# Altium schematic sheet esp32.SchDoc
size A
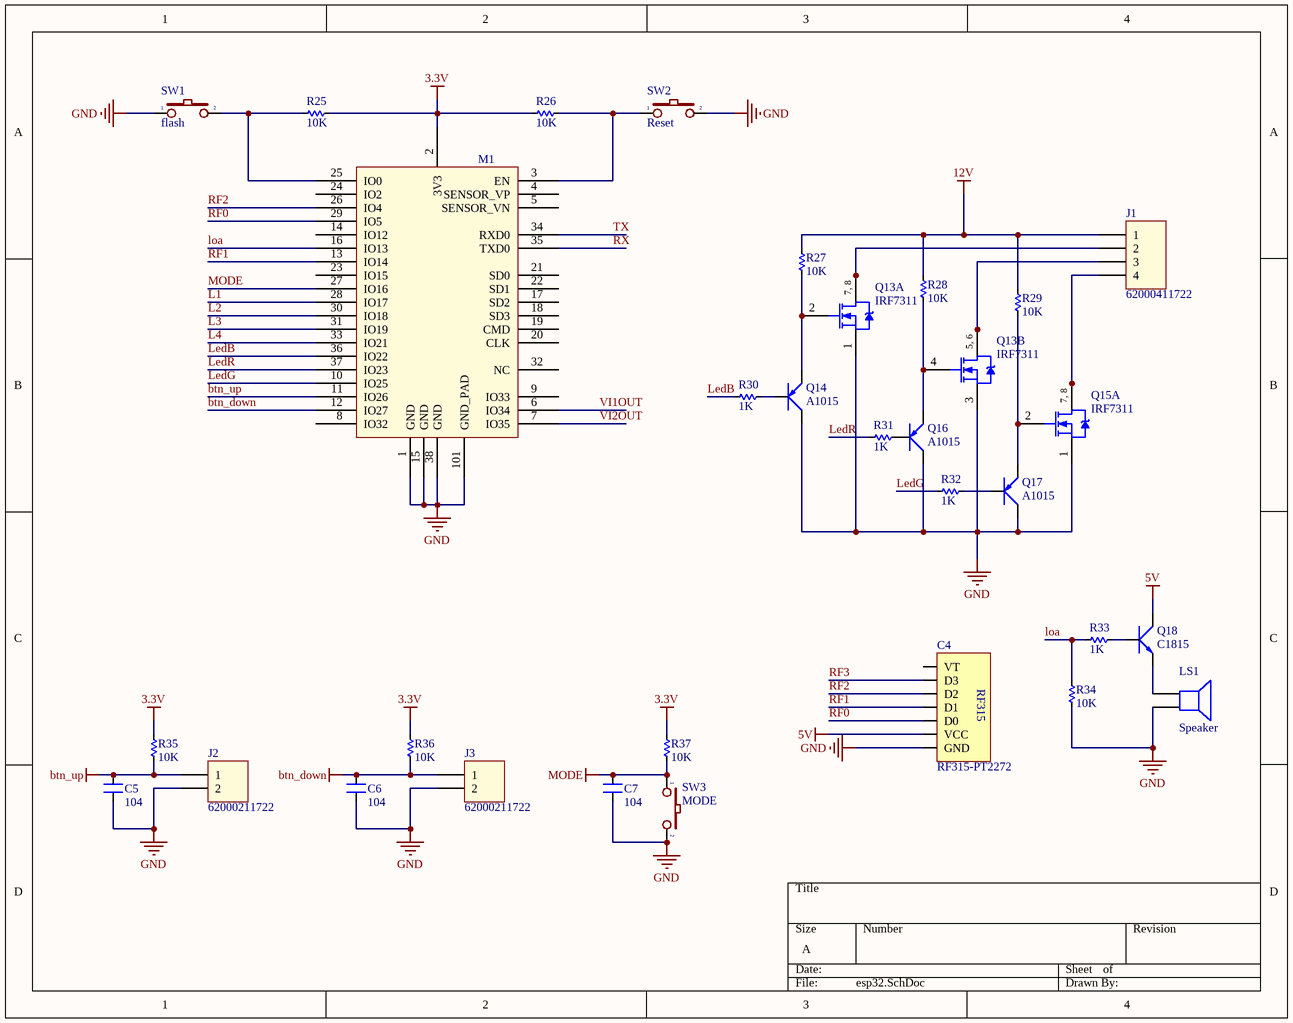
[diagram p0: esp32.SchDoc]

## Parts
C4  RF315-PT2272  [RF315-2272]
C5  104  [SM-CAP-0805]
C6  104  [SM-CAP-0805]
C7  104  [SM-CAP-0805]
J1  62000411722  [62000411722]
J2  62000211722  [62000211722]
J3  62000211722  [62000211722]
LS1  Speaker  [SPEAKER]
M1  ESP32S_Module  [ESP32S]  (value not drawn)
Q13  IRF7311  [SO-8_N]  (parts A,B of 2)
Q14  A1015  [SOT23B]
Q15  IRF7311  [SO-8_N]  (part A of 2)
Q16  A1015  [SOT23B]
Q17  A1015  [SOT23B]
Q18  C1815  [SOT23B]
R25  10K  [RES-SMD-0805]
R26  10K  [RES-SMD-0805]
R27  10K  [RES-SMD-0805]
R28  10K  [RES-SMD-0805]
R29  10K  [RES-SMD-0805]
R30  1K  [RES-SMD-0805]
R31  1K  [RES-SMD-0805]
R32  1K  [RES-SMD-0805]
R33  1K  [RES-SMD-0805]
R34  10K  [RES-SMD-0805]
R35  10K  [RES-SMD-0805]
R36  10K  [RES-SMD-0805]
R37  10K  [RES-SMD-0805]
SW1  flash  [SW-DIP1-1]
SW2  Reset  [SW1-SMD]
SW3  MODE  [SW-DIP1-1]

## Nets
3.3V: M1.2(3V3) R25.2 R26.1 R35.2 R36.2 R37.2
5V: C4.6(VCC) Q18.2(C)
12V: J1.1 R27.1 R28.1 R29.1
btn_down: C6.2 J3.1 M1.12(IO27) R36.1
btn_up: C5.2 J2.1 M1.11(IO26) R35.1
GND: C4.7(GND) C5.1 C6.1 C7.1 J2.2 J3.2 LS1.2 M1.1(GND) M1.15(GND) M1.38(GND) M1.101(GND_PAD) Q13.1(S) Q13.3(S) Q14.2(C) Q15.1(S) Q16.2(C) Q17.2(C) R34.2 SW1.1 SW2.2 SW3.2
MODE: C7.2 M1.27(IO16) R37.1 SW3.1
L1: M1.28(IO17)
L2: M1.30(IO18)
L3: M1.31(IO19)
L4: M1.33(IO21)
LedB: M1.36(IO22) R30.2
LedG: M1.10(IO25) R32.2
LedR: M1.37(IO23) R31.2
loa: M1.16(IO13) R33.2 R34.1
RF0: C4.5(D0) M1.29(IO5)
RF1: C4.4(D1) M1.13(IO14)
RF2: C4.3(D2) M1.26(IO4)
RF3: C4.2(D3)
RX: M1.35(TXD0)
TX: M1.34(RXD0)
VI1OUT: M1.6(IO34)
VI2OUT: M1.7(IO35)
NetJ1_2: J1.2 Q13.7(D) Q13.8(D)
NetJ1_3: J1.3 Q13.5(D) Q13.6(D)
NetJ1_4: J1.4 Q15.7(D) Q15.8(D)
NetLS1_1: LS1.1 Q18.1(E)
NetM1_3: M1.3(EN) R26.2 SW2.1
NetM1_25: M1.25(IO0) R25.1 SW1.2
NetQ13_2: Q13.2(G) Q14.1(E) R27.2
NetQ13_4: Q13.4(G) Q16.1(E) R28.2
NetQ14_3: Q14.3(B) R30.1
NetQ15_2: Q15.2(G) Q17.1(E) R29.2
NetQ16_3: Q16.3(B) R31.1
NetQ17_3: Q17.3(B) R32.1
NetQ18_3: Q18.3(B) R33.1

Not connected (* = marked no-connect by the designer): C4 1(VT); M1 4(SENSOR_VP) 5(SENSOR_VN) 8(IO32) 9(IO33) 14(IO12) 17(SD2) 18(SD3) 19(CMD) 20(CLK) 21(SD0) 22(SD1) 23(IO15) 24(IO2) 32(NC)

## Notes on the sheet
- (in symbol IRF7101, part A) 7, 8
- (in symbol IRF7101, part B) 5, 6
- (in symbol RF315-PT2272) RF315

## Library data of the parts
C4 = RF315-PT2272: Manufacturer: W¨¹rth Elektronik eiSos GmbH; partNo: 613004143121; ComponentLink1 Description: Manufacturer; ComponentLink2 Description: Datasheet; NoPins: 04; Created Date: 29 March 2013; ComponentLink1URL: http://www.we-online.com; ComponentLink2URL: http://katalog.we-online.de/em/datasheet/6130xx143121.pdf; Created by: Karrer Zheng
C5-C7 = CN: Value: 0,1uF/300V; Designed by: VanDungEvn
J1 = 62000411722: WR-WTB 2.00mm Male Horizontal Shrouded Header, 4p; Pin Number: 4; ComponentLink1Description: Manufacturer; ComponentLink1URL: http://www.we-online.de; ComponentLink2Description: Datasheet; ComponentLink2URL: http://katalog.we-online.de/em/datasheet/6200xx11722.pdf; Part Number: 62000411722; Published Date: June 2017; Publisher: Wurth Elektronik; Pitch: 2.00 mm
J2 J3 = 62000211722: WR-WTB 2.00mm Male Horizontal Shrouded Header, 2p; Pin Number: 2; ComponentLink1Description: Manufacturer; ComponentLink1URL: http://www.we-online.de; ComponentLink2Description: Datasheet; ComponentLink2URL: http://katalog.we-online.de/em/datasheet/6200xx11722.pdf; Part Number: 62000211722; Published Date: June 2017; Publisher: Wurth Elektronik; Pitch: 2.00 mm
LS1 = Speaker: Loudspeaker; Published: 24-Mar-1999; LatestRevisionDate: 17-Jul-2002; LatestRevisionNote: Re-released for DXP Platform.; PackageReference: PIN2; Publisher: Altium Limited
M1 = ESP32S_Module: Esp-32S; Datasheet: https://espressif.com/sites/default/files/documentation/esp_wroom_32_datasheet_en.pdf
Q13 Q15 = IRF7101: HEXFET Power MOSFET; Published: 8-Jun-2000; LatestRevisionDate: 13-Apr-2006; LatestRevisionNote: IPC-7351 Footprint Added.; DatasheetVersion: Aug-1997; PackageVersion: Feb-2001; PackageReference: SO-8; Publisher: Altium Limited; PackageDescription: 8-Pin Plastic Small Outline Integrated Circuit 1.27 mm Pitch; Code_JEDEC: MS-012-AA; Code_IPC: SOIC127P600-8; ComponentLink1Description: Manufacturer Link; ComponentLink1URL: http://www.irf.com/; ComponentLink2Description: Datasheet; ComponentLink2URL: http://www.irf.com/product-info/datasheets/data/irf7101.pdf
Q14 Q16 Q17 = A1015: PNP 600mW, ECB; Value: A1015
Q18 = C1815: NPN 600mW, ECB; Value: C1815
R25-R37 = Res-SMD: Resistor; Manufacturer: Generic Components; Class: Passive; Published: 08/06/2000; Publisher: Altium Hobart Technology Centre
SW1-SW3 = SW2: Switch button 2 pin; Value: SW chip 2 pin